# Altium schematic sheet ain.SchDoc: Main Board
size A4; ApprovedBy: Kijan; Author: Kijan; DrawnBy: Kijan; DocumentFullPathAndName: ""; DocumentName: ""
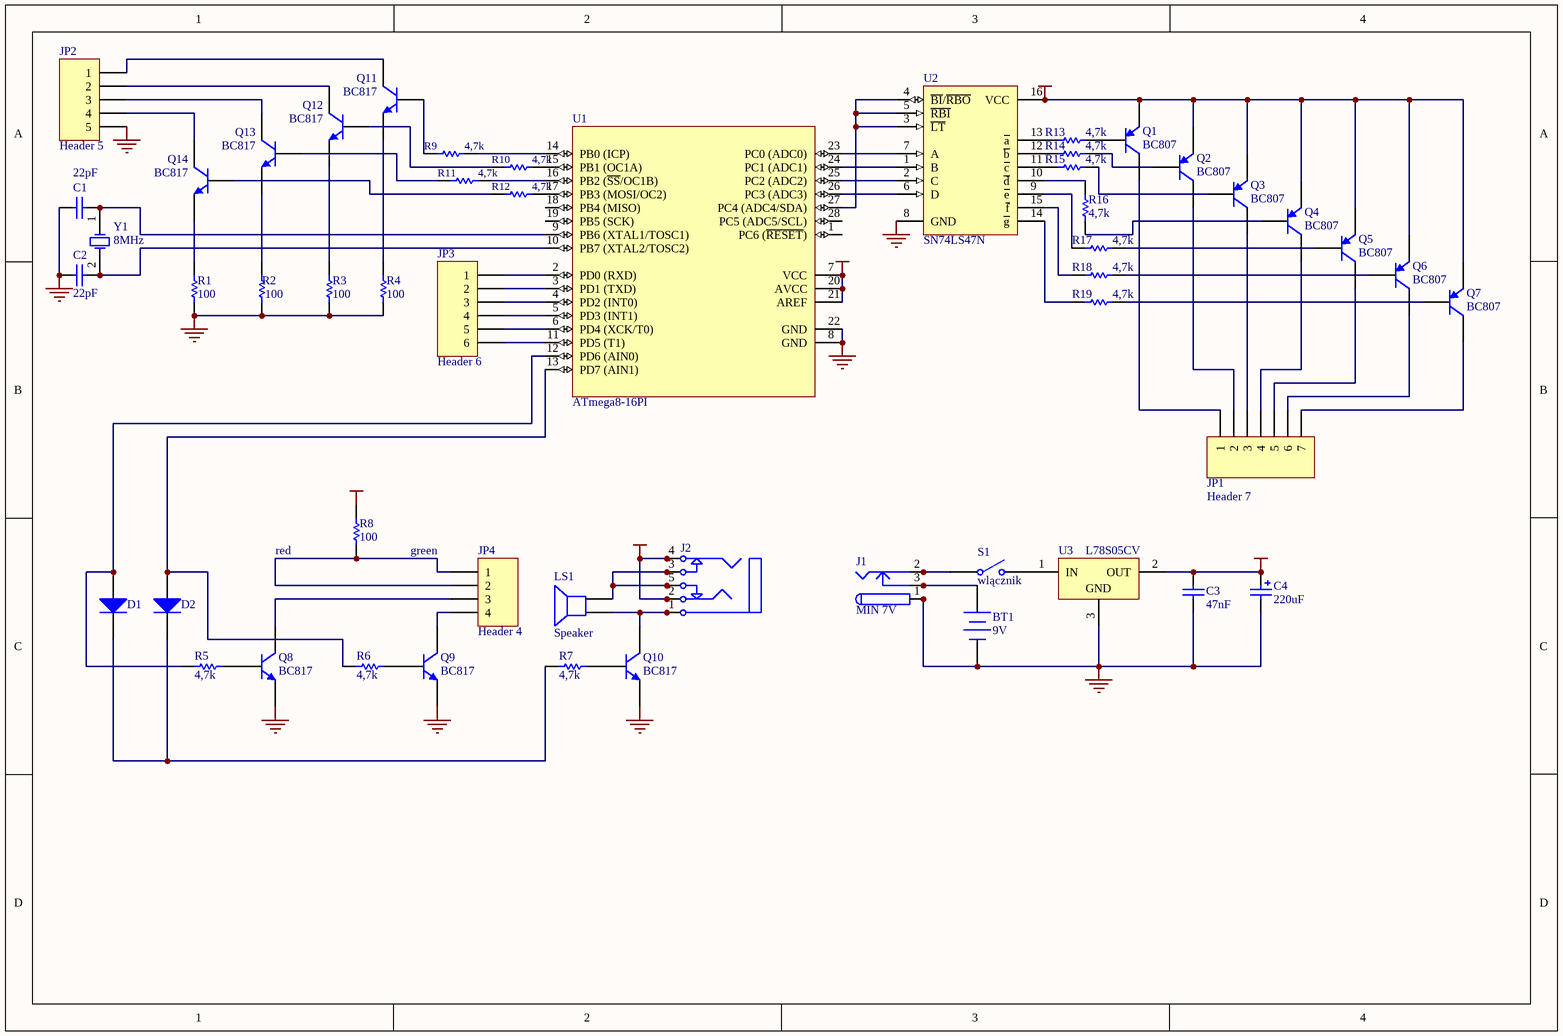
[diagram p0: ain.SchDoc]

## Parts
BT1  9V  [BAT-2]
C1  value 22pF  [RAD-0.1]  (hidden comment: Cap)
C2  value 22pF  [RAD-0.1]  (hidden comment: Cap)
C3  value 47nF  [RAD-0.1]  (hidden comment: Cap)
C4  value 220uF  [CAPPR2-5X6.8]  (hidden comment: Cap Pol1)
D1  Diode  [DSO-C2/X2.3]  (value not drawn)
D2  Diode  [DSO-C2/X2.3]  (value not drawn)
J1  MIN 7V  [KLD-0202]
J2  Phonejack Stereo SW  [Stereo b-jack]  (value not drawn)
JP1  Header 7  [HDR1X7]
JP2  Header 5  [HDR1X5]
JP3  Header 6  [HDR1X6]
JP4  Header 4  [HDR1X4]
LS1  Speaker  [PIN2]
Q1  BC807  [SOT23]
Q2  BC807  [SOT23]
Q3  BC807  [SOT23]
Q4  BC807  [SOT23]
Q5  BC807  [SOT23]
Q6  BC807  [SOT23]
Q7  BC807  [SOT23]
Q8  BC817  [SOT23]
Q9  BC817  [SOT23]
Q10  BC817  [SOT23]
Q11  BC817  [SOT23]
Q12  BC817  [SOT23]
Q13  BC817  [SOT23]
Q14  BC817  [SOT23]
R1  value 100  [CR2012-0805]  (hidden comment: Res1)
R2  value 100  [CR2012-0805]  (hidden comment: Res1)
R3  value 100  [CR2012-0805]  (hidden comment: Res1)
R4  value 100  [CR2012-0805]  (hidden comment: Res1)
R5  value 4,7k  [CR2012-0805]  (hidden comment: Res1)
R6  value 4,7k  [CR2012-0805]  (hidden comment: Res1)
R7  value 4,7k  [CR2012-0805]  (hidden comment: Res1)
R8  value 100  [CR2012-0805]  (hidden comment: Res1)
R9  value 4,7k  [CR2012-0805]  (hidden comment: Res1)
R10  value 4,7k  [CR2012-0805]  (hidden comment: Res1)
R11  value 4,7k  [CR2012-0805]  (hidden comment: Res1)
R12  value 4,7k  [CR2012-0805]  (hidden comment: Res1)
R13  value 4,7k  [CR2012-0805]  (hidden comment: Res1)
R14  value 4,7k  [CR2012-0805]  (hidden comment: Res1)
R15  value 4,7k  [CR2012-0805]  (hidden comment: Res1)
R16  value 4,7k  [CR2012-0805]  (hidden comment: Res1)
R17  value 4,7k  [CR2012-0805]  (hidden comment: Res1)
R18  value 4,7k  [CR2012-0805]  (hidden comment: Res1)
R19  value 4,7k  [CR2012-0805]  (hidden comment: Res1)
S1  wlącznik  [SPST-2]
U1  ATmega8-16PI  [28P3]
U2  SN74LS47N  [N016]
U3  L78S05CV  [TO220VW]
Y1  8MHz  [RAD-0.2]

## Nets
GND: BT1.2(-) C1.1 C2.1 C3.1 C4.2 J1.1 J1.1A J1.1B JP2.5 Q8.2(E) Q9.2(E) Q10.2(E) R1.1 R2.1 R3.1 R4.1 U1.8(GND) U1.22(GND) U2.8(GND) U3.3(GND)
VCC: C3.2 C4.1 J2.2 J2.2A J2.2B J2.4 J2.4A J2.4B Q1.2(E) Q2.2(E) Q3.2(E) Q4.2(E) Q5.2(E) Q6.2(E) Q7.2(E) R8.2 U1.7(VCC) U1.20(AVCC) U1.21(AREF) U2.16(VCC) U3.2(OUT)
NetBT1_1: BT1.1(+) J1.3 J1.3A J1.3B
NetC1_2: C1.2 U1.9(PB6_(XTAL1/TOSC1)) Y1.1(OSC1)
NetC2_2: C2.2 U1.10(PB7_(XTAL2/TOSC2)) Y1.2(OSC2)
NetD1_1: D1.1(A) R5.1 U1.12(PD6_(AIN0))
NetD1_2: D1.2(K) D2.2(K) R7.1
NetD2_1: D2.1(A) R6.1 U1.13(PD7_(AIN1))
NetJ1_2: J1.2 J1.2A J1.2B S1.1(COMMON)
NetJ2_1: J2.1 J2.1A J2.1B LS1.2 Q10.3(C)
NetJ2_3: J2.3 J2.3A J2.3B J2.5 J2.5A J2.5B LS1.1
NetJP1_1: JP1.1 Q1.3(C)
NetJP1_2: JP1.2 Q2.3(C)
NetJP1_3: JP1.3 Q3.3(C)
NetJP1_4: JP1.4 Q4.3(C)
NetJP1_5: JP1.5 Q5.3(C)
NetJP1_6: JP1.6 Q6.3(C)
NetJP1_7: JP1.7 Q7.3(C)
NetJP2_1: JP2.1 Q11.3(C)
NetJP2_2: JP2.2 Q12.3(C)
NetJP2_3: JP2.3 Q13.3(C)
NetJP2_4: JP2.4 Q14.3(C)
NetJP3_1: JP3.1 U1.2(PD0_(RXD))
NetJP3_2: JP3.2 U1.3(PD1_(TXD))
NetJP3_3: JP3.3 U1.4(PD2_(INT0))
NetJP3_4: JP3.4 U1.5(PD3_(INT1))
NetJP3_5: JP3.5 U1.6(PD4_(XCK/T0))
NetJP3_6: JP3.6 U1.11(PD5_(T1))
NetJP4_1: JP4.1 JP4.2 R8.1
NetJP4_3: JP4.3 Q8.3(C)
NetJP4_4: JP4.4 Q9.3(C)
NetQ1_1: Q1.1(B) R13.2
NetQ2_1: Q2.1(B) R14.2
NetQ3_1: Q3.1(B) R15.2
NetQ4_1: Q4.1(B) R16.2
NetQ5_1: Q5.1(B) R17.2
NetQ6_1: Q6.1(B) R18.2
NetQ7_1: Q7.1(B) R19.2
NetQ8_1: Q8.1(B) R5.2
NetQ9_1: Q9.1(B) R6.2
NetQ10_1: Q10.1(B) R7.2
NetQ11_1: Q11.1(B) R9.1
NetQ11_2: Q11.2(E) R4.2
NetQ12_1: Q12.1(B) R10.1
NetQ12_2: Q12.2(E) R3.2
NetQ13_1: Q13.1(B) R11.1
NetQ13_2: Q13.2(E) R2.2
NetQ14_1: Q14.1(B) R12.1
NetQ14_2: Q14.2(E) R1.2
NetR9_2: R9.2 U1.14(PB0_(ICP))
NetR10_2: R10.2 U1.15(PB1_(OC1A))
NetR11_2: R11.2 U1.16(PB2_(~{SS}/OC1B))
NetR12_2: R12.2 U1.17(PB3_(MOSI/OC2))
NetR13_1: R13.1 U2.13(~{a})
NetR14_1: R14.1 U2.12(~{b})
NetR15_1: R15.1 U2.11(~{c})
NetR16_1: R16.1 U2.10(~{d})
NetR17_1: R17.1 U2.9(~{e})
NetR18_1: R18.1 U2.15(~{f})
NetR19_1: R19.1 U2.14(~{g})
NetS1_2: S1.2(NO) U3.1(IN)
NetU1_23: U1.23(PC0_(ADC0)) U2.7(A)
NetU1_24: U1.24(PC1_(ADC1)) U2.1(B)
NetU1_25: U1.25(PC2_(ADC2)) U2.2(C)
NetU1_26: U1.26(PC3_(ADC3)) U2.6(D)
NetU1_27: U1.27(PC4_(ADC4/SDA)) U2.3(~{LT}) U2.4(~{BI}/~{RBO}) U2.5(~{RBI})

Not connected (* = marked no-connect by the designer): U1 1(PC6_(~{RESET})) 18(PB4_(MISO)) 19(PB5_(SCK)) 28(PC5_(ADC5/SCL))

## Notes on the sheet
- red
- green

## Library data of the parts
BT1 = Battery: Multicell Battery; Published: 24-Mar-1999; Revision: July-2002: Re-released for DXP Platform.; Publisher: Altium Limited
C1-C3 = Cap: Capacitor; Published: 8-Jun-2000; Revision: July-2002: Re-released for DXP Platform.; Publisher: Altium Limited
C4 = Cap Pol1: Polarized Capacitor (Radial); Published: 8-Jun-2000; Revision: July-2002: Re-released for DXP Platform.; Publisher: Altium Limited
D1 D2 = Diode: Default Diode; Code - JEDEC: DO-214-AB; Published: 8-Jun-2000; Revision: July-2002: Re-released for DXP Platform.; Publisher: Altium Limited
J1 = PWR2.5: Low Voltage Power Supply Connector; Published: 17-Dec-2003; Datasheet: Latest Revision: 09-May-2002; Publisher: Altium Limited
J2 = Phonejack Stereo SW: 3-Conductor Jack with 2 break contacts (normals) and 2 auxiliary make contacts; pin to pad: 1>G0 2>L0 3>R2 4>R0 5>L1; Revision 1: 17-Jul-2002: Re-released for DXP Platform.; Revision 2: 17-Dec-2003: PCB Footprint replaced.; Publisher: Altium Limited; Published: 5-Jan-2004; Datasheet: Latest Revision: 07-Mar-2000
JP1 = Header 7: Header, 7-Pin; Revision: 17-Jul-2002: Re-released for DXP Platform.; Publisher: Altium Limited
JP2 = Header 5: Header, 5-Pin; Revision: 17-Jul-2002: Re-released for DXP Platform.; Publisher: Altium Limited
JP3 = Header 6: Header, 6-Pin; Revision: 17-Jul-2002: Re-released for DXP Platform.; Publisher: Altium Limited
JP4 = Header 4: Header, 4-Pin; Revision: 17-Jul-2002: Re-released for DXP Platform.; Publisher: Altium Limited
LS1 = Speaker: Loudspeaker; Published: 24-Mar-1999; Revision: July-2002: Re-released for DXP Platform.; Publisher: Altium Limited
Q1-Q7 = BC807: PNP General-purpose Transistor; Package Information: Latest Revision: May-1999; Published: 17-Sep-2003; Datasheet: Latest Revision: 8-Apr-1999; Package Reference: SOT23; Publisher: Altium Limited
Q8-Q14 = BC817: NPN General-purpose Transistor; Package Information: Latest Revision: May-1999; Published: 17-Sep-2003; Datasheet: Latest Revision: 1-Jun-1999; Package Reference: SOT23; Publisher: Altium Limited
R1-R19 = Res1: Resistor; Published: 8-Jun-2000; Revision: July-2002: Re-released for DXP Platform.; Publisher: Altium Limited
S1 = SW-SPST: Single-Pole, Single-Throw Switch; Published: 24-Mar-1999; Revision: July-2002: Re-released for DXP Platform.; Publisher: Altium Limited
U1 = ATmega8-16PI: 8-Bit AVR Microcontroller with 8K Bytes of In-System Programmable Flash Memory; Package Information: Latest Revision: revB, Sep-2001; Published: 17-Sep-2003; Datasheet: Latest Revision: 2486H-AVR-09/02; Package Reference: 28P3; Publisher: Altium Limited
U2 = SN74LS47N: BCD-to-Seven-Segment Decoder/Driver; Revision 1: 12-Jul-2000: SIM Model Added.; Revision 2: 17-Jul-2002: Re-released for DXP Platform.; Package Information: Latest Revision: Oct-1995; Code - JEDEC: MS-001-BB; Published: 8-Jun-2000; Datasheet: Latest Revision: Mar-1988; Package Reference: N016; Publisher: Altium Limited
U3 = L78S05CV: 2A Positive Voltage Regulator; Package Information: Latest Revision: Apr-1998; Note: Tab is connected to pin 3 (GND).; Published: 24-Aug-2001; Revision: 17-Jul-2002: Re-released for DXP Platform.; Datasheet: Latest Revision: Jan-1993; Package Reference: TO220VW; Publisher: Altium Limited
Y1 = XTAL: Crystal Oscillator; Published: 8-Jun-2000; Revision: July-2002: Re-released for DXP Platform.; Publisher: Altium Limited